# Altium schematic sheet Control.SchDoc
size A3; SheetNumber: 1; SheetTotal: 7
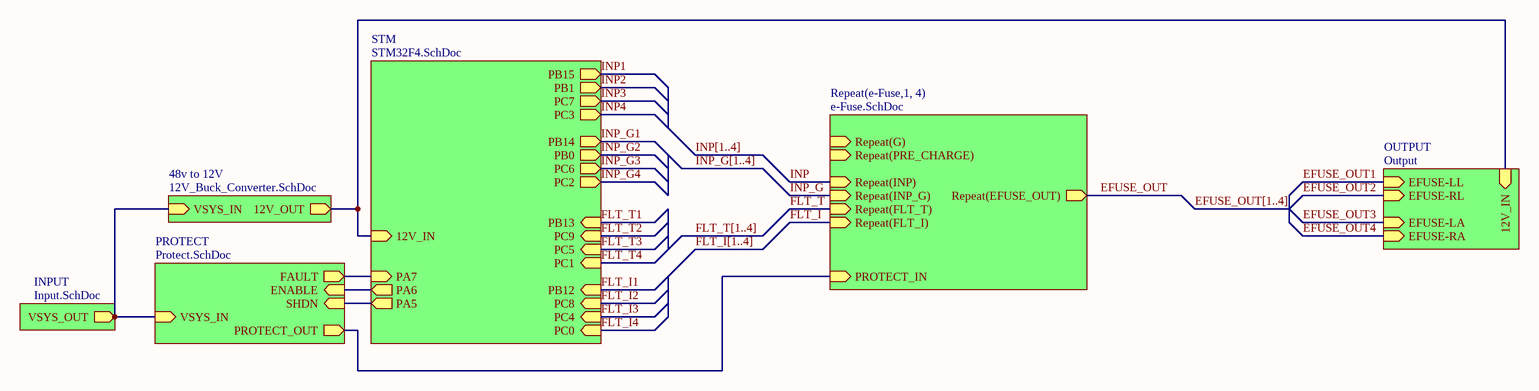
[diagram p0: Control.SchDoc]

## Sub-sheets
48v to 12V = 12V_Buck_Converter.SchDoc: VSYS_IN (in), 12V_OUT (out)
INPUT = Input.SchDoc: VSYS_OUT (out)
OUTPUT = Output: 12V_IN (in), EFUSE-LL (in), EFUSE-RA (in), EFUSE-RL (in), EFUSE-LA (in)
PROTECT = Protect.SchDoc: VSYS_IN (in), SHDN (in), ENABLE (in), FAULT (out), PROTECT_OUT (out)
Repeat(e-Fuse,1, 4) = e-Fuse.SchDoc: PROTECT_IN (in), Repeat(PRE_CHARGE) (in), Repeat(EFUSE_OUT) (out), Repeat(G) (in), Repeat(FLT_I) (in), Repeat(FLT_T) (in), Repeat(INP_G) (in), Repeat(INP) (in)
STM = STM32F4.SchDoc: 12V_IN (in), PC0 (in), PC1 (in), PC2 (out), PC3 (out), PC4 (in), PC5 (in), PC6 (out), PC7 (out), PC8 (in), PC9 (in), PB0 (out), PB1 (out), PB12 (in), PB13 (in), PB14 (out), PB15 (out), PA5 (out), PA6 (out), PA7 (in)

## Nets
EFUSE_OUT: sheet Repeat(e-Fuse,1, 4)/Repeat(EFUSE_OUT)
EFUSE_OUT1: sheet OUTPUT/EFUSE-LL
EFUSE_OUT2: sheet OUTPUT/EFUSE-RL
EFUSE_OUT3: sheet OUTPUT/EFUSE-LA
EFUSE_OUT4: sheet OUTPUT/EFUSE-RA
FLT_I: sheet Repeat(e-Fuse,1, 4)/Repeat(FLT_I)
FLT_I1: sheet STM/PB12
FLT_I2: sheet STM/PC8
FLT_I3: sheet STM/PC4
FLT_I4: sheet STM/PC0
FLT_T: sheet Repeat(e-Fuse,1, 4)/Repeat(FLT_T)
FLT_T1: sheet STM/PB13
FLT_T2: sheet STM/PC9
FLT_T3: sheet STM/PC5
FLT_T4: sheet STM/PC1
INP: sheet Repeat(e-Fuse,1, 4)/Repeat(INP)
INP1: sheet STM/PB15
INP2: sheet STM/PB1
INP3: sheet STM/PC7
INP4: sheet STM/PC3
INP_G: sheet Repeat(e-Fuse,1, 4)/Repeat(INP_G)
INP_G1: sheet STM/PB14
INP_G2: sheet STM/PB0
INP_G3: sheet STM/PC6
INP_G4: sheet STM/PC2
(unnamed): sheet INPUT/VSYS_OUT, sheet PROTECT/VSYS_IN, sheet 48v to 12V/VSYS_IN
(unnamed): sheet PROTECT/SHDN, sheet STM/PA5
(unnamed): sheet PROTECT/ENABLE, sheet STM/PA6
(unnamed): sheet PROTECT/FAULT, sheet STM/PA7
(unnamed): sheet PROTECT/PROTECT_OUT, sheet Repeat(e-Fuse,1, 4)/PROTECT_IN
(unnamed): sheet STM/12V_IN, sheet OUTPUT/12V_IN, sheet 48v to 12V/12V_OUT

## Buses and harness runs
bus EFUSE_OUT[1..4]
bus FLT_I[1..4]
bus FLT_T[1..4]
bus INP[1..4]
bus INP_G[1..4]